# EAGLE design AC_breakout (EAGLE 5.10)
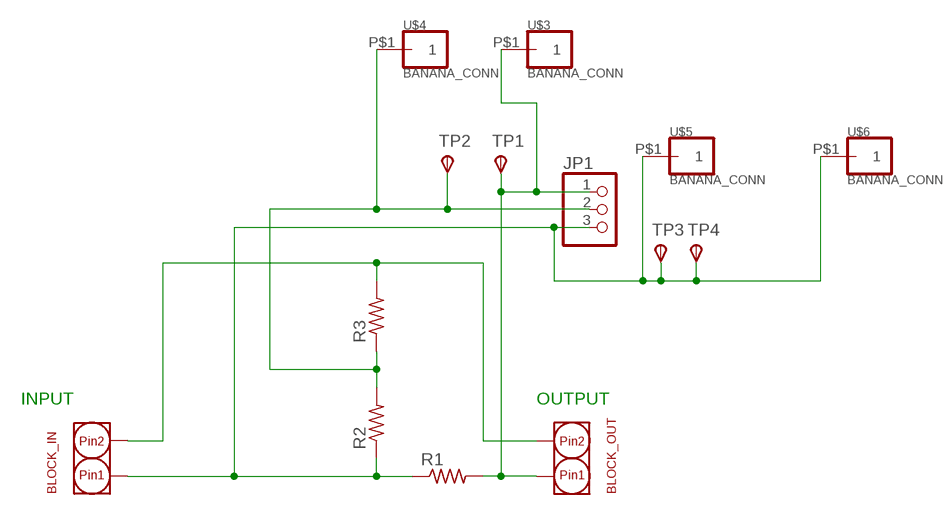
[diagram p0: schematic, sheet 1]

## Parts
BLOCK_IN  EUROESTYLE_TERMINAL_BLOCK_27.5MM_SPACE  [EUROESTYLE_TERMINAL_BLOCK_2]
BLOCK_OUT  EUROESTYLE_TERMINAL_BLOCK_27.5MM_SPACE  [EUROESTYLE_TERMINAL_BLOCK_2]
JP1  PINHD-1X3  [1X03]
R1  R-US_0617/17  [0617/17]
R2  R-US_0309/10  [0309/10]
R3  R-US_0309/10  [0309/10]
TP1  TPSTP20SQ  [TP20SQ]
TP2  TPSTP20SQ  [TP20SQ]
TP3  TPSTP20SQ  [TP20SQ]
TP4  TPSTP20SQ  [TP20SQ]
U$3  BANANA_CONN  [BANANA_CONN]
U$4  BANANA_CONN  [BANANA_CONN]
U$5  BANANA_CONN  [BANANA_CONN]
U$6  BANANA_CONN  [BANANA_CONN]

## Nets
AGND: BLOCK_IN.PIN1 JP1.3 R1.1 R2.1 TP3.TP(PP) TP4.TP(PP) U$5.P$1 U$6.P$1
I+: BLOCK_OUT.PIN1 JP1.1 R1.2 TP1.TP(PP) U$3.P$1
N$5: BLOCK_IN.PIN2 BLOCK_OUT.PIN2 R3.2
V+: JP1.2 R2.2 R3.1 TP2.TP(PP) U$4.P$1

## Notes on the sheet
- INPUT | OUTPUT

## Library data of the parts
BLOCK_IN BLOCK_OUT = myConnectors:EUROESTYLE_TERMINAL_BLOCK_2
JP1 = pinhead:PINHD-1X3: PIN HEADER
R1-R3 = resistor:R-US_: RESISTOR, American symbol
TP1-TP4 = testpad:TPS: TEST PIN
U$3-U$6 = SparkFun:BANANA_CONN

## Board
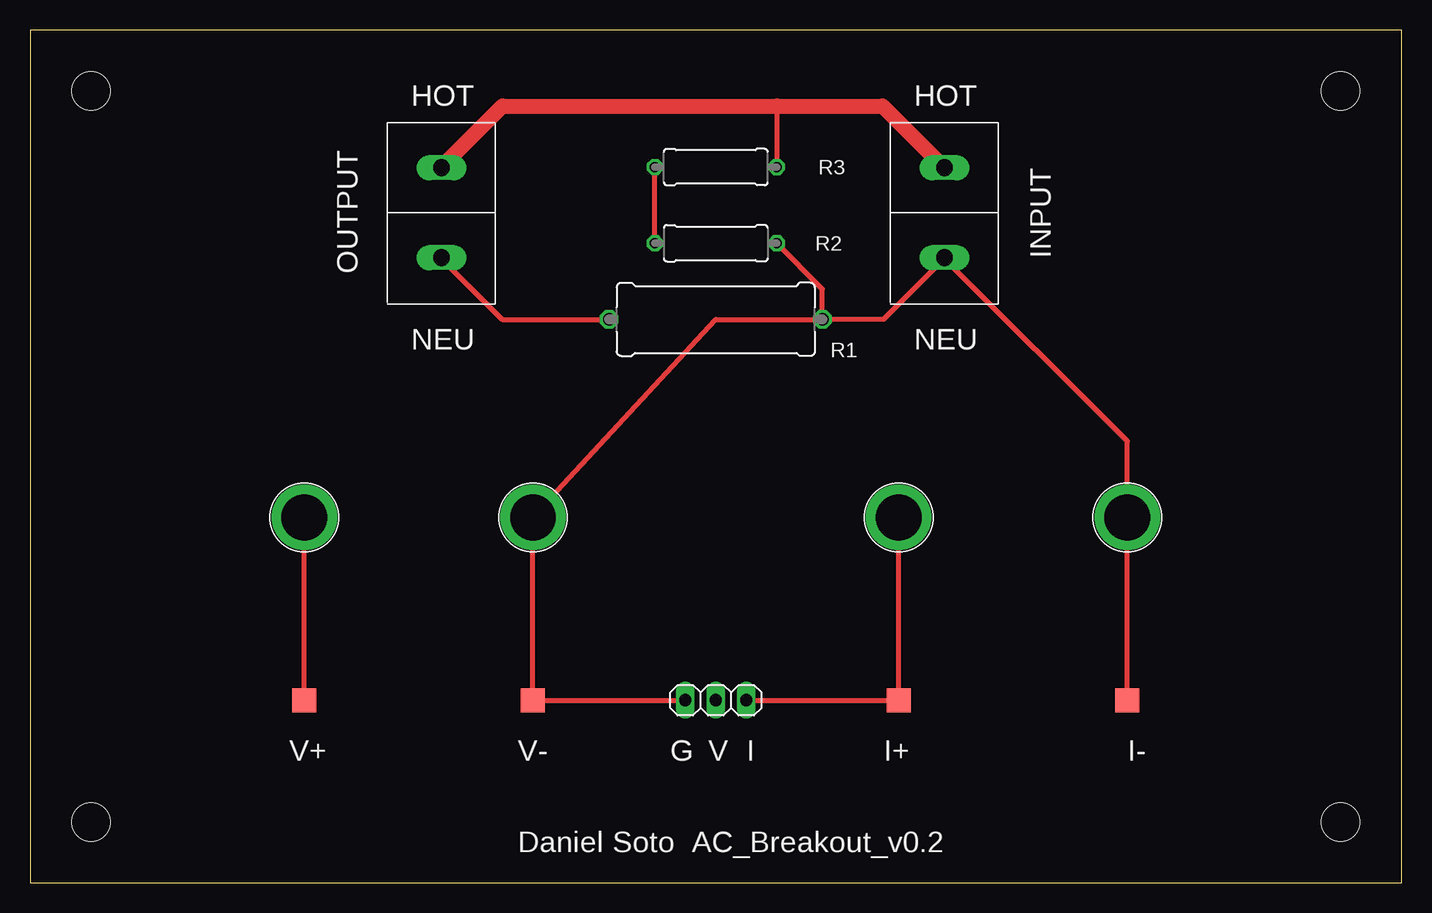
[diagram p1: board, top side]
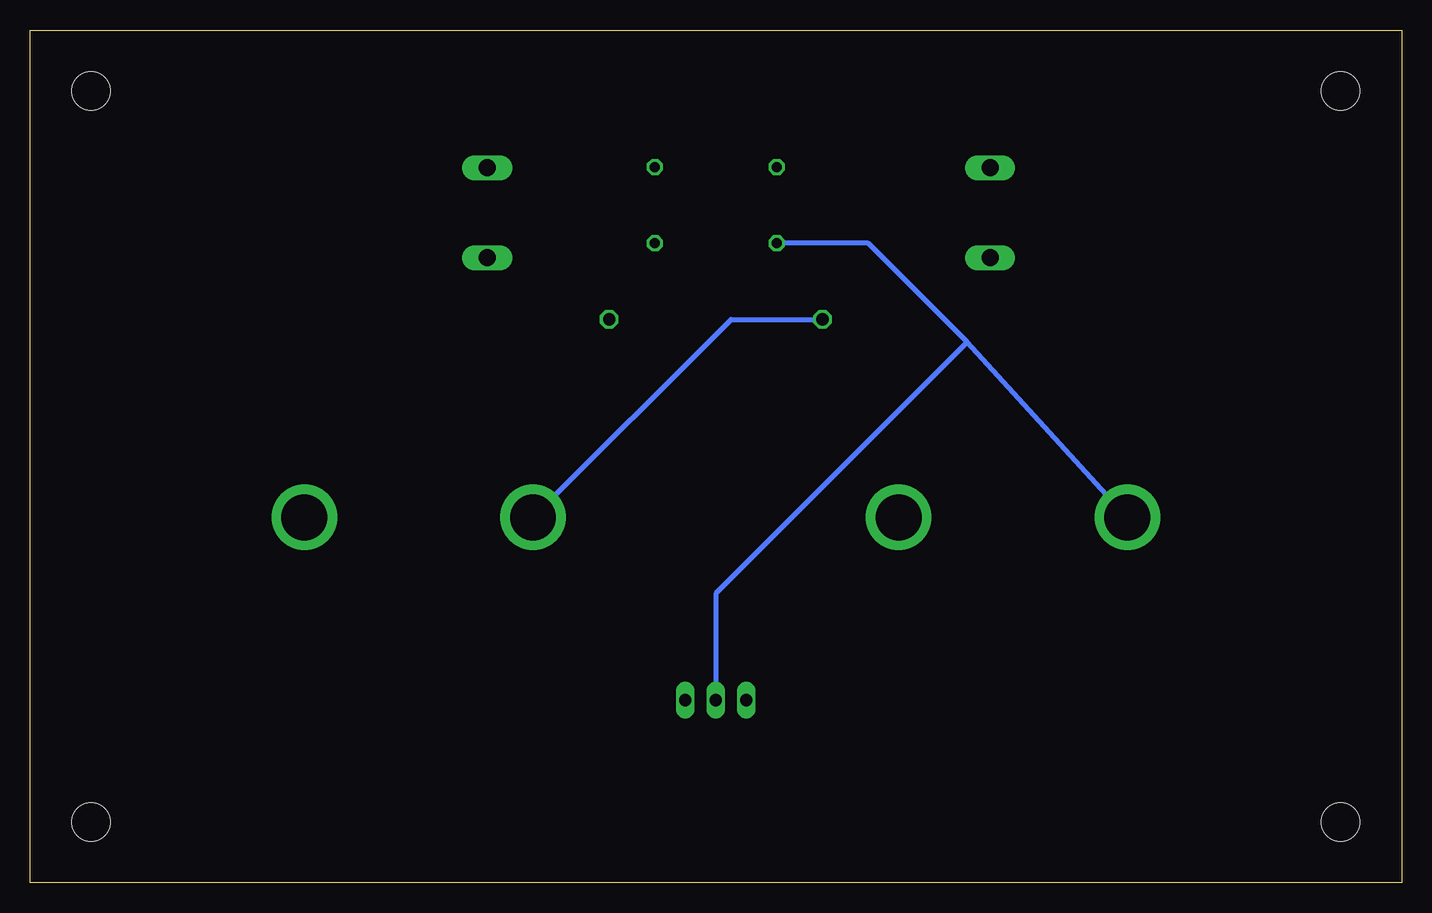
[diagram p2: board, bottom side, seen from below]

Size 114.3 x 71.12 mm. Coordinates in mm from the lower left corner, seen from the top.
Outline: 0,0 114.3,0 114.3,71.12 0,71.12 0,0
Copper layers (1*16): Top 0.035mm / dielectric 1.5mm / Bottom 0.035mm
Design rules "default": minimum track width 10mil, minimum drill 24mil, track to track 8mil, track to pad 8mil, pad to pad 8mil, via to via 8mil, smd to smd 8mil, copper to edge 40mil, drill to drill 8mil, minimum pad ring 10mil, minimum via ring 8mil, stop-mask expansion 4mil, vias tented up to drill 0mil, thermal gap 10mil
Holes 3.2 mm at 5.08,66.04 109.22,66.04 109.22,5.08 5.08,5.08

### Footprints (pad centres in the part's own frame; a part is rotated, then mirrored left to right if it is on the bottom)
EUROESTYLE_TERMINAL_BLOCK_2 = drill 1.4 pad 1.93 long: PIN1 -3.75,0; PIN2 3.75,0
1X03 = drill 1.016 long: 1 -2.54,0; 2 0,0; 3 2.54,0
0617/17 = drill 1.016 octagon: 1 -8.89,0; 2 8.89,0
0309/10 = drill 0.813 octagon: 1 -5.08,0; 2 5.08,0
TP20SQ = smd 2 x 2: TP 0,0
BANANA_CONN = drill 3.81 pad 5.461 round: P$1 0,0

### Placement (x,y rotation side)
BLOCK_IN  76.2,55.88 90 top
BLOCK_OUT  34.29,55.88 90 top
JP1  57.15,15.24 180 top
R1  57.15,46.99 180 top
R2  57.15,53.34 180 top
R3  57.15,59.69 0 top
TP1  72.39,15.24 0 top
TP2  22.86,15.24 0 top
TP3  91.44,15.24 0 top
TP4  41.91,15.24 0 top
U$3  72.39,30.48 0 top
U$4  22.86,30.48 0 top
U$5  41.91,30.48 0 top
U$6  91.44,30.48 0 top

### Tracks (layer width: path | path; a pad name or v marks a point on that pad's centre or on a via)
AGND
  Top 0.406: TP3.TP U$6.P$1 91.44,36.83 76.2,52.07 | JP1.3 TP4.TP U$5.P$1 57.15,46.99 R1.1 | R2.1 66.04,49.53 R1.1 | BLOCK_IN.PIN1 76.2,52.07 | 76.2,52.07 71.12,46.99 R1.1
I+
  Top 0.406: U$3.P$1 TP1.TP JP1.1 | BLOCK_OUT.PIN1 34.29,52.07 39.37,46.99 R1.2
  Bottom 0.406: R1.2 55.88,46.99 U$3.P$1
N$5
  Top 0.406: 62.23,64.77 R3.2
  Top 1.27: BLOCK_OUT.PIN2 34.29,59.69 39.37,64.77 62.23,64.77 71.06,64.77 BLOCK_IN.PIN2
V+
  Top 0.406: R2.2 R3.1 | TP2.TP U$4.P$1
  Bottom 0.406: R2.2 44.45,53.34 36.2,45.09 | U$4.P$1 36.2,45.09 | JP1.2 57.15,24.13 36.2,45.09

### Text on the board
tPlace: HOT | HOT | INPUT | OUTPUT | NEU | NEU | V+ | V- | G | V | I | I+ | I- | Daniel Soto AC_Breakout_v0.2